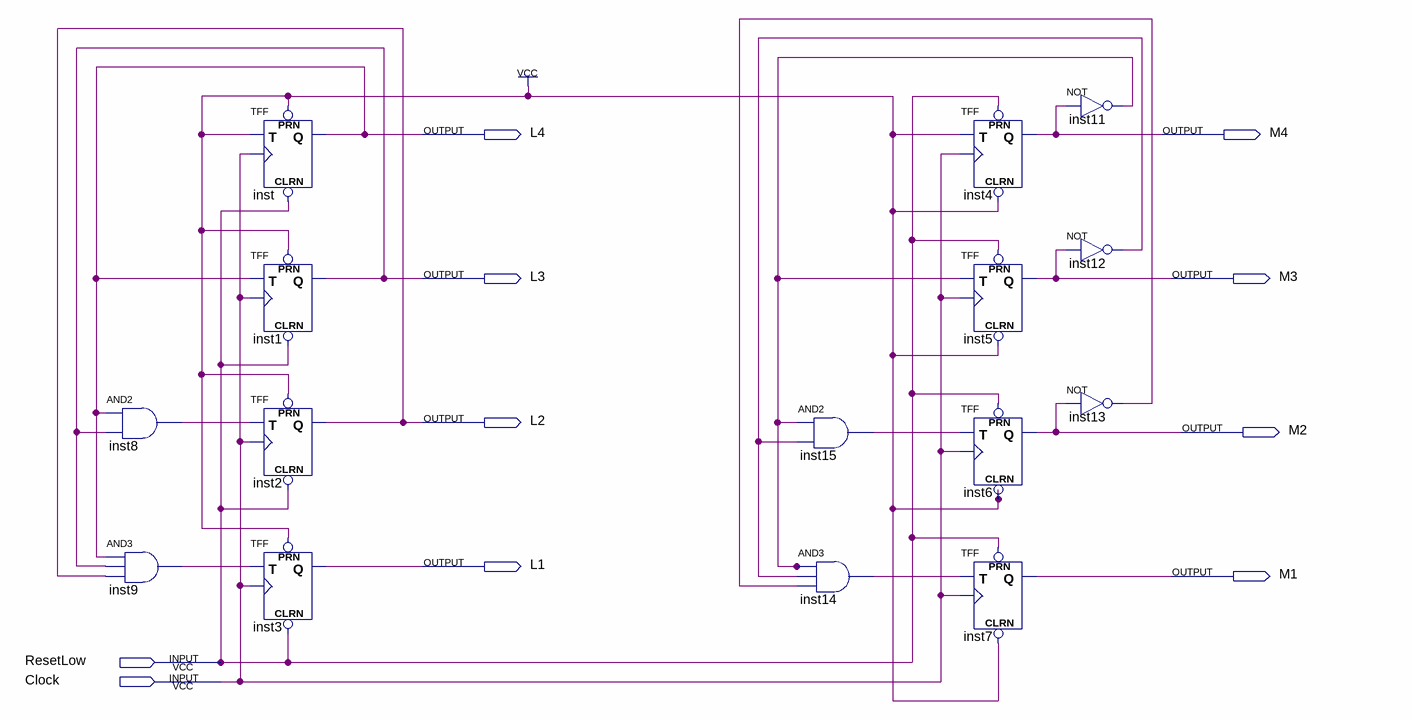
[diagram p0: schematic sheet]
// Quartus schematic moore_state_machine.bdf as structural Verilog: 15 symbols, 10 pins
module moore_state_machine (
  input  ResetLow,
  input  Clock,
  output L4,
  output M4,
  output L3,
  output M3,
  output L2,
  output M2,
  output L1,
  output M1
);

  wire inst8_out, inst9_out, inst11_out, inst12_out, inst13_out, inst14_out, inst15_out;

  and inst8 (inst8_out, L4, L3);
  and inst9 (inst9_out, L4, L3, L2);
  TFF inst (.PRN(1'b1), .CLRN(ResetLow), .T(1'b1), .CLK(Clock), .Q(L4));
  TFF inst1 (.PRN(1'b1), .CLRN(ResetLow), .T(L4), .CLK(Clock), .Q(L3));
  TFF inst2 (.PRN(1'b1), .CLRN(ResetLow), .T(inst8_out), .CLK(Clock), .Q(L2));
  TFF inst3 (.PRN(1'b1), .CLRN(ResetLow), .T(inst9_out), .CLK(Clock), .Q(L1));
  and inst15 (inst15_out, inst11_out, inst12_out);
  and inst14 (inst14_out, inst11_out, inst12_out, inst13_out);
  TFF inst4 (.PRN(ResetLow), .CLRN(1'b1), .T(1'b1), .CLK(Clock), .Q(M4));
  TFF inst5 (.PRN(ResetLow), .CLRN(1'b1), .T(inst11_out), .CLK(Clock), .Q(M3));
  TFF inst6 (.PRN(ResetLow), .CLRN(1'b1), .T(inst15_out), .CLK(Clock), .Q(M2));
  TFF inst7 (.PRN(ResetLow), .CLRN(1'b1), .T(inst14_out), .CLK(Clock), .Q(M1));
  not inst11 (inst11_out, M4);
  not inst12 (inst12_out, M3);
  not inst13 (inst13_out, M2);
endmodule
